# Altium schematic sheet FPGA_GND_NC.SchDoc: Sayma AMC
size 420 x 297 mm; $$Internal___BlkDate: 0:12:25_2-9-18; $$Internal_NAME_PLACEHOLDER: a3sheet; $$Internal_Resolution: 00001mm; $$NotCommonProperty_@NAME: FPGA_XCKU040FFVA1156; $$NotCommonProperty_@PRINTORDER: 23; $$NotCommonProperty_@SHEET: FPGA GND NC; $$NotCommonProperty_@SHEETTOTAL: 30; CmpIndex: 995; Drawing Author: G.Kasprowicz; Drawing Number: Sayma AMC; Drawing Project: AMC FMC Carrier Board; Drawing Revision: 2.0; SymIndex: 2141; CheckedBy: P.Kulik,T.Przywozki,W.Ruclo; Author: G.Kasprowicz; CompanyName: WUT ISE; DrawnBy: G.Kasprowicz; Organization: WUT ISE; Address1: PW ISE; Address2: Nowowiejska 15/19 00-665 Warsaw; Address3: gkasprow@gmail.com; DocumentNumber: 31; Revision: 2; SheetNumber: 31; SheetTotal: 32; ModifiedBy: -; CheckedDate: -; Title2: FPGA power ports; DivGrp: WUT ISE; Designer: G.Kasprowicz; ModifiedDate: -; ProjectName: Sensor Box
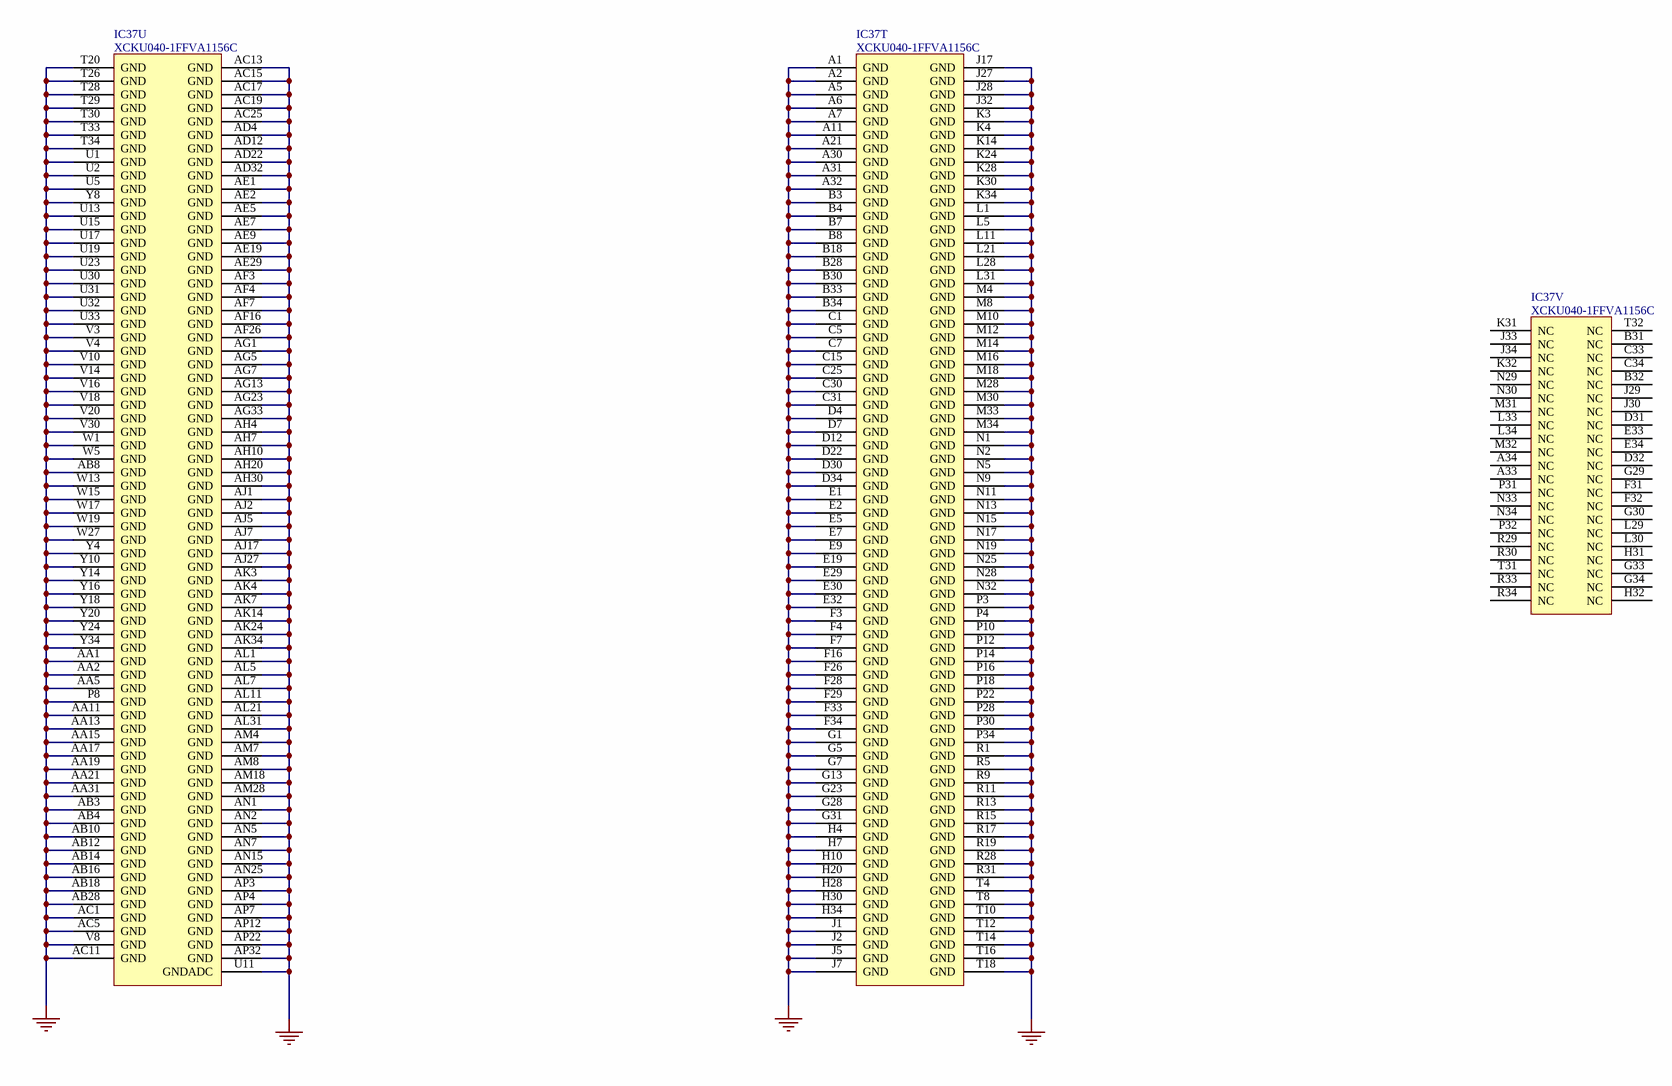
[diagram p0: FPGA_GND_NC.SchDoc]

## Parts
IC37  XCKU040-1FFVA1156C  [BGA1156C100P34X34_3500X3500X350]  (parts T,U,V of 22)

## Nets
GND: IC37.A1(GND) IC37.A2(GND) IC37.A5(GND) IC37.A6(GND) IC37.A7(GND) IC37.A11(GND) IC37.A21(GND) IC37.A30(GND) IC37.A31(GND) IC37.A32(GND) IC37.AA1(GND) IC37.AA2(GND) IC37.AA5(GND) IC37.AA11(GND) IC37.AA13(GND) IC37.AA15(GND) IC37.AA17(GND) IC37.AA19(GND) IC37.AA21(GND) IC37.AA31(GND) IC37.AB3(GND) IC37.AB4(GND) IC37.AB8(GND) IC37.AB10(GND) IC37.AB12(GND) IC37.AB14(GND) IC37.AB16(GND) IC37.AB18(GND) IC37.AB28(GND) IC37.AC1(GND) IC37.AC5(GND) IC37.AC11(GND) IC37.AC13(GND) IC37.AC15(GND) IC37.AC17(GND) IC37.AC19(GND) IC37.AC25(GND) IC37.AD4(GND) IC37.AD12(GND) IC37.AD22(GND) IC37.AD32(GND) IC37.AE1(GND) IC37.AE2(GND) IC37.AE5(GND) IC37.AE7(GND) IC37.AE9(GND) IC37.AE19(GND) IC37.AE29(GND) IC37.AF3(GND) IC37.AF4(GND) IC37.AF7(GND) IC37.AF16(GND) IC37.AF26(GND) IC37.AG1(GND) IC37.AG5(GND) IC37.AG7(GND) IC37.AG13(GND) IC37.AG23(GND) IC37.AG33(GND) IC37.AH4(GND) IC37.AH7(GND) IC37.AH10(GND) IC37.AH20(GND) IC37.AH30(GND) IC37.AJ1(GND) IC37.AJ2(GND) IC37.AJ5(GND) IC37.AJ7(GND) IC37.AJ17(GND) IC37.AJ27(GND) IC37.AK3(GND) IC37.AK4(GND) IC37.AK7(GND) IC37.AK14(GND) IC37.AK24(GND) IC37.AK34(GND) IC37.AL1(GND) IC37.AL5(GND) IC37.AL7(GND) IC37.AL11(GND) IC37.AL21(GND) IC37.AL31(GND) IC37.AM4(GND) IC37.AM7(GND) IC37.AM8(GND) IC37.AM18(GND) IC37.AM28(GND) IC37.AN1(GND) IC37.AN2(GND) IC37.AN5(GND) IC37.AN7(GND) IC37.AN15(GND) IC37.AN25(GND) IC37.AP3(GND) IC37.AP4(GND) IC37.AP7(GND) IC37.AP12(GND) IC37.AP22(GND) IC37.AP32(GND) IC37.B3(GND) IC37.B4(GND) IC37.B7(GND) IC37.B8(GND) IC37.B18(GND) IC37.B28(GND) IC37.B30(GND) IC37.B33(GND) IC37.B34(GND) IC37.C1(GND) IC37.C5(GND) IC37.C7(GND) IC37.C15(GND) IC37.C25(GND) IC37.C30(GND) IC37.C31(GND) IC37.D4(GND) IC37.D7(GND) IC37.D12(GND) IC37.D22(GND) IC37.D30(GND) IC37.D34(GND) IC37.E1(GND) IC37.E2(GND) IC37.E5(GND) IC37.E7(GND) IC37.E9(GND) IC37.E19(GND) IC37.E29(GND) IC37.E30(GND) IC37.E32(GND) IC37.F3(GND) IC37.F4(GND) IC37.F7(GND) IC37.F16(GND) IC37.F26(GND) IC37.F28(GND) IC37.F29(GND) IC37.F33(GND) IC37.F34(GND) IC37.G1(GND) IC37.G5(GND) IC37.G7(GND) IC37.G13(GND) IC37.G23(GND) IC37.G28(GND) IC37.G31(GND) IC37.H4(GND) IC37.H7(GND) IC37.H10(GND) IC37.H20(GND) IC37.H28(GND) IC37.H30(GND) IC37.H34(GND) IC37.J1(GND) IC37.J2(GND) IC37.J5(GND) IC37.J7(GND) IC37.J17(GND) IC37.J27(GND) IC37.J28(GND) IC37.J32(GND) IC37.K3(GND) IC37.K4(GND) IC37.K14(GND) IC37.K24(GND) IC37.K28(GND) IC37.K30(GND) IC37.K34(GND) IC37.L1(GND) IC37.L5(GND) IC37.L11(GND) IC37.L21(GND) IC37.L28(GND) IC37.L31(GND) IC37.M4(GND) IC37.M8(GND) IC37.M10(GND) IC37.M12(GND) IC37.M14(GND) IC37.M16(GND) IC37.M18(GND) IC37.M28(GND) IC37.M30(GND) IC37.M33(GND) IC37.M34(GND) IC37.N1(GND) IC37.N2(GND) IC37.N5(GND) IC37.N9(GND) IC37.N11(GND) IC37.N13(GND) IC37.N15(GND) IC37.N17(GND) IC37.N19(GND) IC37.N25(GND) IC37.N28(GND) IC37.N32(GND) IC37.P3(GND) IC37.P4(GND) IC37.P8(GND) IC37.P10(GND) IC37.P12(GND) IC37.P14(GND) IC37.P16(GND) IC37.P18(GND) IC37.P22(GND) IC37.P28(GND) IC37.P30(GND) IC37.P34(GND) IC37.R1(GND) IC37.R5(GND) IC37.R9(GND) IC37.R11(GND) IC37.R13(GND) IC37.R15(GND) IC37.R17(GND) IC37.R19(GND) IC37.R28(GND) IC37.R31(GND) IC37.T4(GND) IC37.T8(GND) IC37.T10(GND) IC37.T12(GND) IC37.T14(GND) IC37.T16(GND) IC37.T18(GND) IC37.T20(GND) IC37.T26(GND) IC37.T28(GND) IC37.T29(GND) IC37.T30(GND) IC37.T33(GND) IC37.T34(GND) IC37.U1(GND) IC37.U2(GND) IC37.U5(GND) IC37.U11(GNDADC) IC37.U13(GND) IC37.U15(GND) IC37.U17(GND) IC37.U19(GND) IC37.U23(GND) IC37.U30(GND) IC37.U31(GND) IC37.U32(GND) IC37.U33(GND) IC37.V3(GND) IC37.V4(GND) IC37.V8(GND) IC37.V10(GND) IC37.V14(GND) IC37.V16(GND) IC37.V18(GND) IC37.V20(GND) IC37.V30(GND) IC37.W1(GND) IC37.W5(GND) IC37.W13(GND) IC37.W15(GND) IC37.W17(GND) IC37.W19(GND) IC37.W27(GND) IC37.Y4(GND) IC37.Y8(GND) IC37.Y10(GND) IC37.Y14(GND) IC37.Y16(GND) IC37.Y18(GND) IC37.Y20(GND) IC37.Y24(GND) IC37.Y34(GND)

Not connected (* = marked no-connect by the designer): IC37 A33(NC) A34(NC) B31(NC) B32(NC) C33(NC) C34(NC) D31(NC) D32(NC) E33(NC) E34(NC) F31(NC) F32(NC) G29(NC) G30(NC) G33(NC) G34(NC) H31(NC) H32(NC) J29(NC) J30(NC) J33(NC) J34(NC) K31(NC) K32(NC) L29(NC) L30(NC) L33(NC) L34(NC) M31(NC) M32(NC) N29(NC) N30(NC) N33(NC) N34(NC) P31(NC) P32(NC) R29(NC) R30(NC) R33(NC) R34(NC) T31(NC) T32(NC)

## Notes on the sheet
- Project/Equipment
- Document
- Designer
- Drawn by
- Check.by
- Copyright WUT ISE 2018.
  This documentation describes Open Hardware and is licensed under the CERN OHL v.1.1. You may redistribute and modify this documentation under the terms of the CERN OHL v.1.1. (http://ohwr.org/CERNOHL). This documentation is distributed WITHOUT ANY EXPRESS OR IMPLIED WARRANTY, INCLUDING OF MERCHANTABILITY, SATISFACTORY QUALITY AND FITNESS FOR A PARTICULAR PURPOSE. Please see the CERN OHL v.1.1 for applicable conditions.
- Contact
- File
- Last Mod.
- Print Date
- Sheet
- Size
- A3
- of
- Rev

## Library data of the parts
IC37 = XCKU040-1FFVA1156C: Kintex UltraScale FPGA, 520 I/O, 530K Cells, 1156-Ball BGA, Speed Grade 1, Commercial Grade; Manufacturer: XILINX; Part Description: Kintex UltraScale, 40 DLL I/O, 416 HP I/O, 104 HR I/O, 1156-Pin BGA, Speed Grade 1, Commercial Grade; PressFit: No; Bonding: No; Manufacturer Part Number: XCKU040-1FFVA1156C; PackageDescription: BGA, 1.00mm Pitch, Square; 1156 Pin, 34 Columns X 34 Rows, Body 35.00mm X 35.00mm X 3.50mm H, IPC Medium Density; Part Number: XCKU040-1FFVA1156C; Component Kind: Standard; Component Type: Standard; Device: XCKU040-1FFVA1156C; Pin Count: 1156; Case: BGA1156; Mounted: Yes; Socket: No; SMD: Yes; Sense: No; ComponentHeight: 3.5mm; HelpURL: \\cern.ch\dfs\Applications\Altium\Datasheets\XCKU040-1FFVA1156C.pdf; ComponentLink1URL: \\cern.ch\dfs\Applications\Altium\Datasheets\XCKU040-1FFVA1156C_Package-Pinout.pdf; ComponentLink1Description: Package/Pinout; Author: CERN DEM CA; CreateDate: 16.08.2016; LatestRevisionDate: 16.08.2016